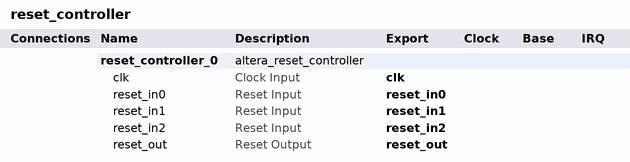
[diagram p0: system contents]
# Platform Designer (Qsys) system reset_controller, Arria 10 10AX115S3F45E2SGE3
# Parameters at their usual value, and those the tool derives, are not listed.
package require -exact qsys 17.0
create_system reset_controller
set_project_property DEVICE_FAMILY {Arria 10}
set_project_property DEVICE 10AX115S3F45E2SGE3

add_instance reset_controller_0 altera_reset_controller 17.0
set_instance_parameter_value reset_controller_0 NUM_RESET_INPUTS 3
set_instance_parameter_value reset_controller_0 SYNC_DEPTH 3

# exported interfaces
add_interface clk clock sink
set_interface_property clk EXPORT_OF reset_controller_0.clk
add_interface reset_in0 reset sink
set_interface_property reset_in0 EXPORT_OF reset_controller_0.reset_in0
add_interface reset_in1 reset sink
set_interface_property reset_in1 EXPORT_OF reset_controller_0.reset_in1
add_interface reset_in2 reset sink
set_interface_property reset_in2 EXPORT_OF reset_controller_0.reset_in2
add_interface reset_out reset source
set_interface_property reset_out EXPORT_OF reset_controller_0.reset_out

set_interconnect_requirement {$system} qsys_mm.clockCrossingAdapter HANDSHAKE
set_interconnect_requirement {$system} qsys_mm.enableEccProtection FALSE
set_interconnect_requirement {$system} qsys_mm.insertDefaultSlave FALSE
set_interconnect_requirement {$system} qsys_mm.maxAdditionalLatency 1

save_system reset_controller.qsys
